# Altium project Temp-Humidity-logger.PrjPcb
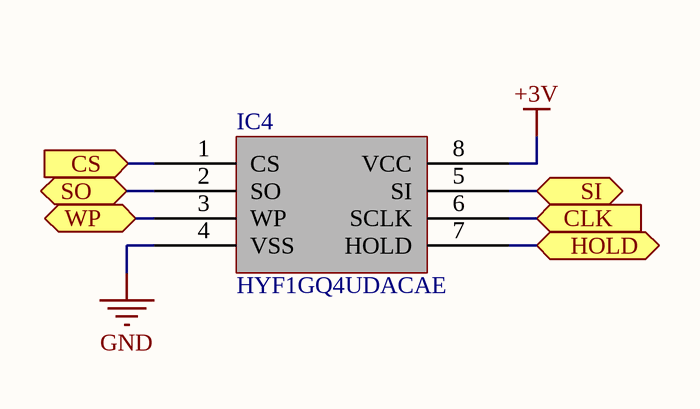
[diagram p0: NAND_Flash.SchDoc]
3 sheets, 4 parts. Net scope: flat (ports and power ports of the same name join across sheets).
Board file: Main-PCB.PcbDoc
Sheets:
  NAND_Flash.SchDoc
  Battery_Management.SchDoc
  LDO.SchDoc

## Sheet NAND_Flash.SchDoc
size A4; SheetNumber: 3; SheetTotal: 7

### Parts
IC4  HYF1GQ4UDACAE  [HeYangTek WSON-8-EP]

### Ports
CLK (in), CS (in), HOLD (bidir), SI (bidir), SO (bidir), WP (bidir)

### Nets
+3V: IC4.8(VCC)
GND: IC4.4(VSS)
NetIC4_1: IC4.1(CS) ; port CS
NetIC4_2: IC4.2(SO) ; port SO
NetIC4_3: IC4.3(WP) ; port WP
NetIC4_5: IC4.5(SI) ; port SI
NetIC4_6: IC4.6(SCLK) ; port CLK
NetIC4_7: IC4.7(HOLD) ; port HOLD

### Library data of the parts
IC4 = HeYangTek HYF1GQ4UDACAE

## Sheet Battery_Management.SchDoc
size A4; SheetNumber: 4; SheetTotal: 4

## Sheet LDO.SchDoc
size A4; SheetNumber: 7; SheetTotal: 7
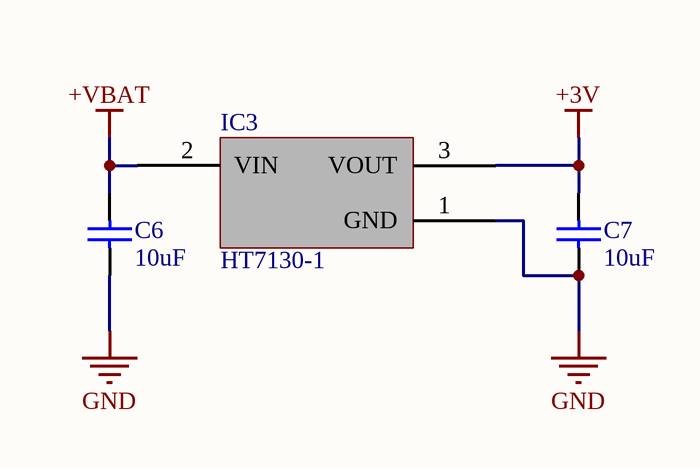
[diagram p1: LDO.SchDoc]

### Parts
C6  value 10uF  [Wurth 0603 capacitor]  (hidden comment: Generic Capacitor 10uF 0603)
C7  value 10uF  [Wurth 0603 capacitor]  (hidden comment: Generic Capacitor 10uF 0603)
IC3  HT7130-1  [UMW SOT89-3]

### Nets
+3V: C7.2 IC3.3(VOUT)
+VBAT: C6.2 IC3.2(VIN)
GND: C6.1 C7.1 IC3.1(GND)

### Library data of the parts
IC3 = UMW HT7130-1: HOLTEK   HT7130-1-SOT89TRLF   Fixed LDO Voltage Regulator, 4V to 24V, 100mV Dropout, 3Vout, 30mAout, SOT-89-3; Supplier: Newark; Supplier Part Number: 53M7841; Manufacturer: Holtek; Manufacturer Part Number: HT7130-1-SOT89TRLF; RoHS: Yes; Category: Voltage Regulators - Linear; Stock: 2; Pricing: 1=0,143, 10=0,143, 25=0,143, 50=0,143, 100=0,143, 250=0,143, 500=0,143, 1000=0,143 (USD); ComponentLink1URL: https://datasheet.ciiva.com/1511/79203-1511505.pdf?src-supplier=Element14; ComponentLink1Description: https://datasheet.ciiva.com/1511/79203-1511505.pdf?src-supplier=Element14

## Nets that join several sheets
+3V: NAND_Flash (IC4.8), LDO (C7.2 IC3.3)
GND: NAND_Flash (IC4.4), LDO (C6.1 C7.1 IC3.1)